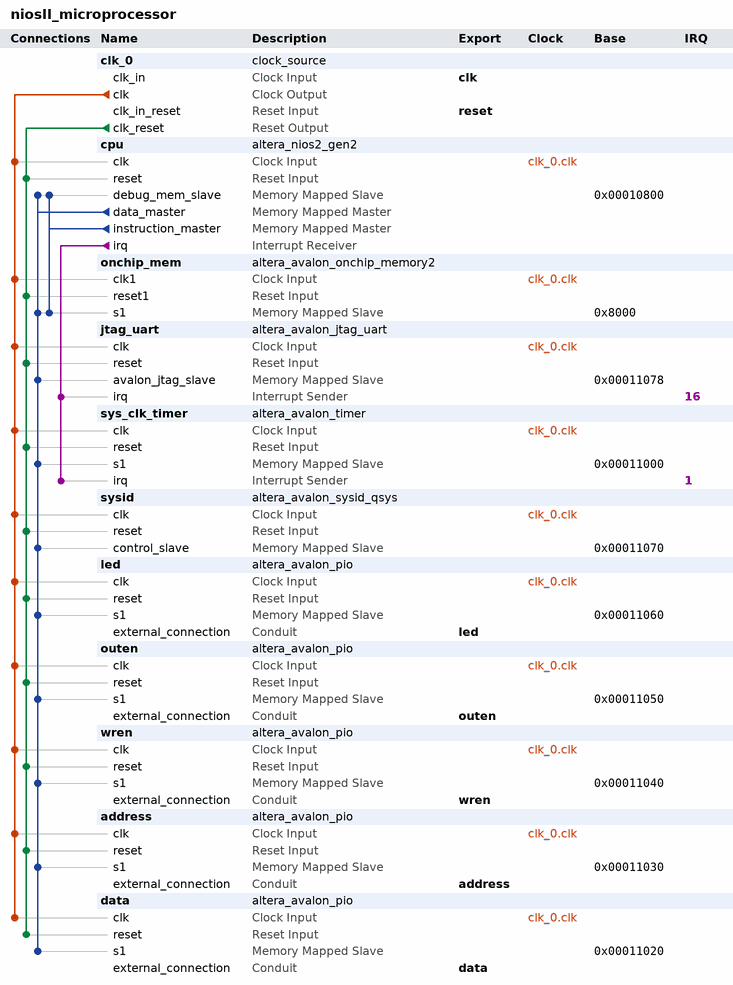
[diagram p0: system contents]
# Platform Designer (Qsys) system niosII_microprocessor, Cyclone V 5CSEMA5F31C6
# Parameters at their usual value, and those the tool derives, are not listed.
package require -exact qsys 15.1
create_system niosII_microprocessor
set_project_property DEVICE_FAMILY {Cyclone V}
set_project_property DEVICE 5CSEMA5F31C6

add_instance clk_0 clock_source 15.1
set_instance_parameter_value clk_0 clockFrequency 50000000

add_instance cpu altera_nios2_gen2 15.1
set_instance_parameter_value cpu dcache_size 0
set_instance_parameter_value cpu exceptionSlave onchip_mem.s1
set_instance_parameter_value cpu icache_size 2048
set_instance_parameter_value cpu impl Fast
set_instance_parameter_value cpu resetSlave onchip_mem.s1
set_instance_parameter_value cpu setting_activateTrace true

add_instance onchip_mem altera_avalon_onchip_memory2 15.1
set_instance_parameter_value onchip_mem dataWidth 32
set_instance_parameter_value onchip_mem dualPort false
set_instance_parameter_value onchip_mem initMemContent true
set_instance_parameter_value onchip_mem initializationFileName onchip_mem.hex
set_instance_parameter_value onchip_mem memorySize 20480

add_instance jtag_uart altera_avalon_jtag_uart 15.1
set_instance_parameter_value jtag_uart simInteractiveOptions NO_INTERACTIVE_WINDOWS

add_instance sys_clk_timer altera_avalon_timer 15.1
set_instance_parameter_value sys_clk_timer period 1
set_instance_parameter_value sys_clk_timer periodUnits MSEC

add_instance sysid altera_avalon_sysid_qsys 15.1
set_instance_parameter_value sysid id 0

add_instance led altera_avalon_pio 15.1
set_instance_parameter_value led direction Output
set_instance_parameter_value led width 8

add_instance outen altera_avalon_pio 15.1
set_instance_parameter_value outen direction Output
set_instance_parameter_value outen width 1

add_instance wren altera_avalon_pio 15.1
set_instance_parameter_value wren direction Output
set_instance_parameter_value wren width 1

add_instance address altera_avalon_pio 15.1
set_instance_parameter_value address direction Output
set_instance_parameter_value address width 11

add_instance data altera_avalon_pio 15.1
set_instance_parameter_value data direction Bidir
set_instance_parameter_value data width 8

# connections
add_connection clk_0.clk address.clk clock
add_connection clk_0.clk cpu.clk clock
add_connection clk_0.clk data.clk clock
add_connection clk_0.clk jtag_uart.clk clock
add_connection clk_0.clk led.clk clock
add_connection clk_0.clk onchip_mem.clk1 clock
add_connection clk_0.clk outen.clk clock
add_connection clk_0.clk sys_clk_timer.clk clock
add_connection clk_0.clk sysid.clk clock
add_connection clk_0.clk wren.clk clock
add_connection clk_0.clk_reset address.reset reset
add_connection clk_0.clk_reset cpu.reset reset
add_connection clk_0.clk_reset data.reset reset
add_connection clk_0.clk_reset jtag_uart.reset reset
add_connection clk_0.clk_reset led.reset reset
add_connection clk_0.clk_reset onchip_mem.reset1 reset
add_connection clk_0.clk_reset outen.reset reset
add_connection clk_0.clk_reset sys_clk_timer.reset reset
add_connection clk_0.clk_reset sysid.reset reset
add_connection clk_0.clk_reset wren.reset reset
add_connection cpu.data_master address.s1 avalon
set_connection_parameter_value cpu.data_master/address.s1 baseAddress 0x00011030
add_connection cpu.data_master cpu.debug_mem_slave avalon
set_connection_parameter_value cpu.data_master/cpu.debug_mem_slave baseAddress 0x00010800
add_connection cpu.data_master data.s1 avalon
set_connection_parameter_value cpu.data_master/data.s1 baseAddress 0x00011020
add_connection cpu.data_master jtag_uart.avalon_jtag_slave avalon
set_connection_parameter_value cpu.data_master/jtag_uart.avalon_jtag_slave baseAddress 0x00011078
add_connection cpu.data_master led.s1 avalon
set_connection_parameter_value cpu.data_master/led.s1 baseAddress 0x00011060
add_connection cpu.data_master onchip_mem.s1 avalon
set_connection_parameter_value cpu.data_master/onchip_mem.s1 baseAddress 0x8000
add_connection cpu.data_master outen.s1 avalon
set_connection_parameter_value cpu.data_master/outen.s1 baseAddress 0x00011050
add_connection cpu.data_master sys_clk_timer.s1 avalon
set_connection_parameter_value cpu.data_master/sys_clk_timer.s1 baseAddress 0x00011000
add_connection cpu.data_master sysid.control_slave avalon
set_connection_parameter_value cpu.data_master/sysid.control_slave baseAddress 0x00011070
add_connection cpu.data_master wren.s1 avalon
set_connection_parameter_value cpu.data_master/wren.s1 baseAddress 0x00011040
add_connection cpu.instruction_master cpu.debug_mem_slave avalon
set_connection_parameter_value cpu.instruction_master/cpu.debug_mem_slave baseAddress 0x00010800
add_connection cpu.instruction_master onchip_mem.s1 avalon
set_connection_parameter_value cpu.instruction_master/onchip_mem.s1 baseAddress 0x8000
add_connection cpu.irq jtag_uart.irq interrupt
set_connection_parameter_value cpu.irq/jtag_uart.irq irqNumber 16
add_connection cpu.irq sys_clk_timer.irq interrupt
set_connection_parameter_value cpu.irq/sys_clk_timer.irq irqNumber 1

# exported interfaces
add_interface address conduit end
set_interface_property address EXPORT_OF address.external_connection
add_interface clk clock sink
set_interface_property clk EXPORT_OF clk_0.clk_in
add_interface data conduit end
set_interface_property data EXPORT_OF data.external_connection
add_interface led conduit end
set_interface_property led EXPORT_OF led.external_connection
add_interface outen conduit end
set_interface_property outen EXPORT_OF outen.external_connection
add_interface reset reset sink
set_interface_property reset EXPORT_OF clk_0.clk_in_reset
add_interface wren conduit end
set_interface_property wren EXPORT_OF wren.external_connection

set_interconnect_requirement {$system} qsys_mm.clockCrossingAdapter HANDSHAKE
set_interconnect_requirement {$system} qsys_mm.insertDefaultSlave FALSE
set_interconnect_requirement {$system} qsys_mm.maxAdditionalLatency 1

save_system niosII_microprocessor.qsys
